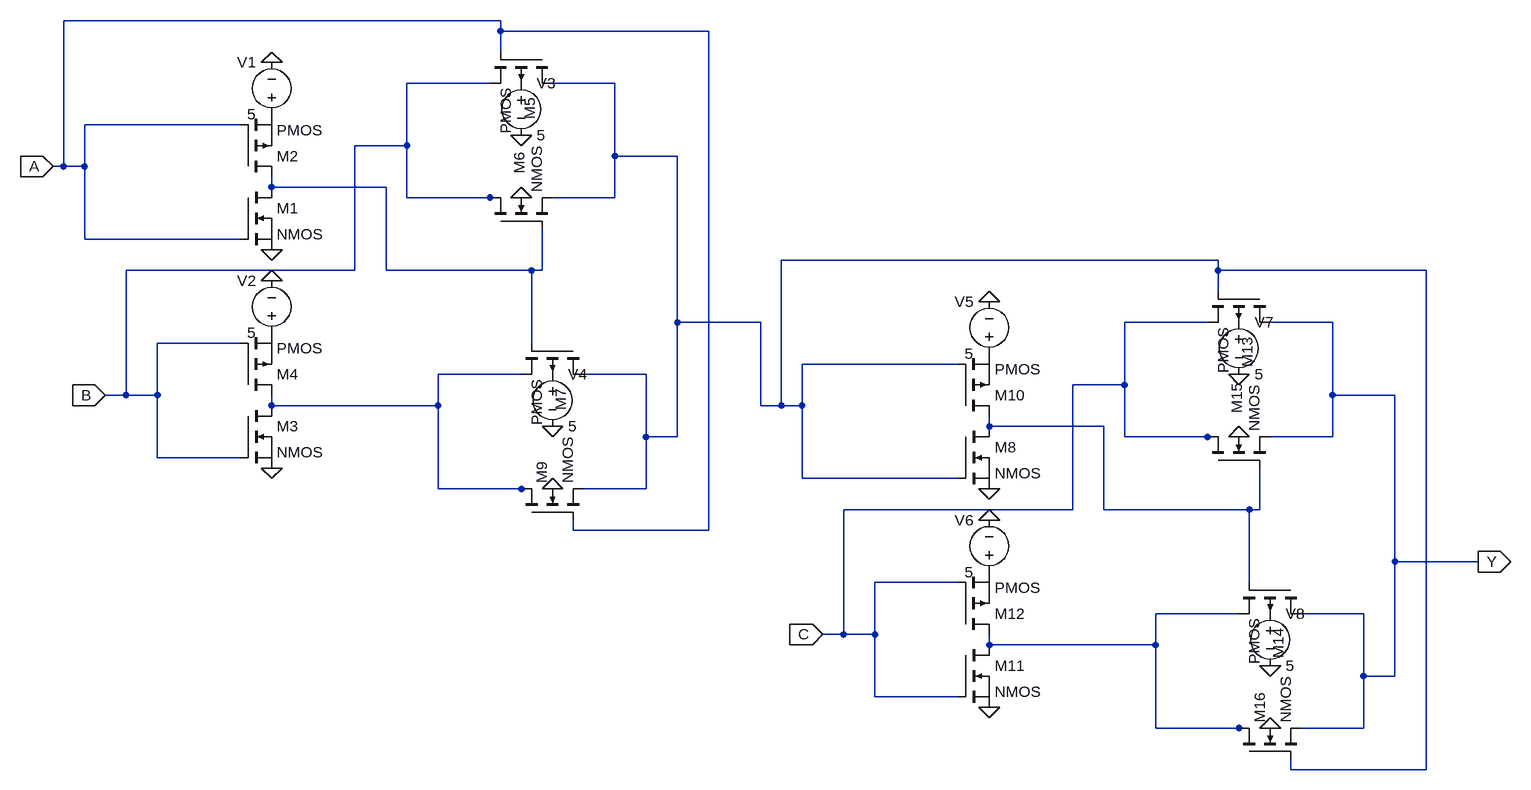
[diagram p0: schematic XOP_Part1.asc]
XOP_Part1.asc, the LTspice schematic file:
Version 4
SHEET 1 1996 788
WIRE 416 -368 -256 -368
WIRE 416 -352 416 -368
WIRE 736 -352 416 -352
WIRE 416 -320 416 -352
WIRE 400 -272 272 -272
WIRE 592 -272 496 -272
WIRE 16 -208 -224 -208
WIRE 272 -176 272 -272
WIRE 272 -176 192 -176
WIRE 592 -160 592 -272
WIRE 688 -160 592 -160
WIRE -256 -144 -256 -368
WIRE -256 -144 -272 -144
WIRE -224 -144 -224 -208
WIRE -224 -144 -256 -144
WIRE 64 -112 64 -128
WIRE 240 -112 64 -112
WIRE 272 -96 272 -176
WIRE 400 -96 272 -96
WIRE 416 -96 400 -96
WIRE 592 -96 592 -160
WIRE 592 -96 496 -96
WIRE -224 -32 -224 -144
WIRE 16 -32 -224 -32
WIRE 1520 0 848 0
WIRE 192 16 192 -176
WIRE 192 16 -160 16
WIRE 240 16 240 -112
WIRE 464 16 240 16
WIRE 480 16 480 -48
WIRE 480 16 464 16
WIRE 1520 16 1520 0
WIRE 1840 16 1520 16
WIRE 1520 48 1520 16
WIRE 688 96 688 -160
WIRE 816 96 688 96
WIRE 1504 96 1376 96
WIRE 1696 96 1600 96
WIRE 16 128 -112 128
WIRE 464 128 464 16
WIRE 1120 160 880 160
WIRE 448 176 320 176
WIRE 640 176 544 176
WIRE 1376 192 1376 96
WIRE 1376 192 1296 192
WIRE -160 208 -160 16
WIRE -160 208 -192 208
WIRE -112 208 -112 128
WIRE -112 208 -160 208
WIRE 1696 208 1696 96
WIRE 1792 208 1696 208
WIRE 64 224 64 208
WIRE 320 224 320 176
WIRE 320 224 64 224
WIRE 816 224 816 96
WIRE 848 224 848 0
WIRE 848 224 816 224
WIRE 880 224 880 160
WIRE 880 224 848 224
WIRE 1168 256 1168 240
WIRE 1344 256 1168 256
WIRE 640 272 640 176
WIRE 688 272 688 96
WIRE 688 272 640 272
WIRE 1376 272 1376 192
WIRE 1504 272 1376 272
WIRE 1520 272 1504 272
WIRE 1696 272 1696 208
WIRE 1696 272 1600 272
WIRE -112 304 -112 208
WIRE 16 304 -112 304
WIRE 880 336 880 224
WIRE 1120 336 880 336
WIRE 320 352 320 224
WIRE 448 352 320 352
WIRE 464 352 448 352
WIRE 640 352 640 272
WIRE 640 352 544 352
WIRE 1296 384 1296 192
WIRE 1296 384 944 384
WIRE 1344 384 1344 256
WIRE 1568 384 1344 384
WIRE 1584 384 1584 320
WIRE 1584 384 1568 384
WIRE 528 416 528 400
WIRE 736 416 736 -352
WIRE 736 416 528 416
WIRE 1792 464 1792 208
WIRE 1920 464 1792 464
WIRE 1120 496 992 496
WIRE 1568 496 1568 384
WIRE 1552 544 1424 544
WIRE 1744 544 1648 544
WIRE 944 576 944 384
WIRE 944 576 912 576
WIRE 992 576 992 496
WIRE 992 576 944 576
WIRE 1168 592 1168 576
WIRE 1424 592 1424 544
WIRE 1424 592 1168 592
WIRE 1744 640 1744 544
WIRE 1792 640 1792 464
WIRE 1792 640 1744 640
WIRE 992 672 992 576
WIRE 1120 672 992 672
WIRE 1424 720 1424 592
WIRE 1552 720 1424 720
WIRE 1568 720 1552 720
WIRE 1744 720 1744 640
WIRE 1744 720 1648 720
WIRE 1632 784 1632 768
WIRE 1840 784 1840 16
WIRE 1840 784 1632 784
FLAG -272 -144 A
IOPIN -272 -144 In
FLAG 64 -16 0
FLAG 64 -304 0
FLAG -192 208 B
IOPIN -192 208 In
FLAG 64 320 0
FLAG 64 32 0
FLAG 448 -192 0
FLAG 496 256 0
FLAG 448 -96 0
FLAG 1168 352 0
FLAG 1168 64 0
FLAG 912 576 C
IOPIN 912 576 In
FLAG 1168 688 0
FLAG 1168 400 0
FLAG 1552 176 0
FLAG 1600 624 0
FLAG 1552 272 0
FLAG 496 352 0
FLAG 1920 464 Y
IOPIN 1920 464 Out
FLAG 1600 720 0
SYMBOL nmos 16 -112 R0
SYMATTR InstName M1
SYMBOL pmos 16 -128 M180
SYMATTR InstName M2
SYMBOL voltage 64 -208 R180
WINDOW 0 24 96 Left 2
WINDOW 3 24 16 Left 2
SYMATTR InstName V1
SYMATTR Value 5
SYMBOL nmos 16 224 R0
SYMATTR InstName M3
SYMBOL pmos 16 208 M180
SYMATTR InstName M4
SYMBOL voltage 64 128 R180
WINDOW 0 24 96 Left 2
WINDOW 3 24 16 Left 2
SYMATTR InstName V2
SYMATTR Value 5
SYMBOL pmos4 496 -320 R90
WINDOW 0 70 35 Left 2
SYMATTR InstName M5
SYMBOL voltage 448 -288 R0
SYMATTR InstName V3
SYMATTR Value 5
SYMBOL pmos4 544 128 R90
WINDOW 0 70 35 Left 2
SYMATTR InstName M7
SYMBOL voltage 496 160 R0
SYMATTR InstName V4
SYMATTR Value 5
SYMBOL nmos4 400 -48 R270
WINDOW 0 84 45 Left 2
SYMATTR InstName M6
SYMBOL nmos4 448 400 R270
SYMATTR InstName M9
SYMBOL nmos 1120 256 R0
SYMATTR InstName M8
SYMBOL pmos 1120 240 M180
SYMATTR InstName M10
SYMBOL voltage 1168 160 R180
WINDOW 0 24 96 Left 2
WINDOW 3 24 16 Left 2
SYMATTR InstName V5
SYMATTR Value 5
SYMBOL nmos 1120 592 R0
SYMATTR InstName M11
SYMBOL pmos 1120 576 M180
SYMATTR InstName M12
SYMBOL voltage 1168 496 R180
WINDOW 0 24 96 Left 2
WINDOW 3 24 16 Left 2
SYMATTR InstName V6
SYMATTR Value 5
SYMBOL pmos4 1600 48 R90
WINDOW 0 70 35 Left 2
SYMATTR InstName M13
SYMBOL voltage 1552 80 R0
SYMATTR InstName V7
SYMATTR Value 5
SYMBOL pmos4 1648 496 R90
WINDOW 0 70 35 Left 2
SYMATTR InstName M14
SYMBOL voltage 1600 528 R0
SYMATTR InstName V8
SYMATTR Value 5
SYMBOL nmos4 1504 320 R270
WINDOW 0 84 45 Left 2
SYMATTR InstName M15
SYMBOL nmos4 1552 768 R270
SYMATTR InstName M16

The netlist it stands for:
* XOP_Part1.asc
M1 N002 A 0 0 NMOS
M2 N002 A P001 P001 PMOS
V1 P001 0 5
M3 N003 B 0 0 NMOS
M4 N003 B P002 P002 PMOS
V2 P002 0 5
M5 N001 A B P003 PMOS
V3 P003 0 5
M7 N001 N002 N003 P004 PMOS
V4 P004 0 5
M6 B N002 N001 0 NMOS
M9 N003 A N001 0 NMOS
M8 N004 N001 0 0 NMOS
M10 N004 N001 P005 P005 PMOS
V5 P005 0 5
M11 N005 C 0 0 NMOS
M12 N005 C P006 P006 PMOS
V6 P006 0 5
M13 Y N001 C P007 PMOS
V7 P007 0 5
M14 Y N004 N005 P008 PMOS
V8 P008 0 5
M15 C N004 Y 0 NMOS
M16 N005 N001 Y 0 NMOS
.model NMOS NMOS
.model PMOS PMOS
.lib standard.mos
.backanno
.end